# EAGLE design Clock (EAGLE 7.2.0)
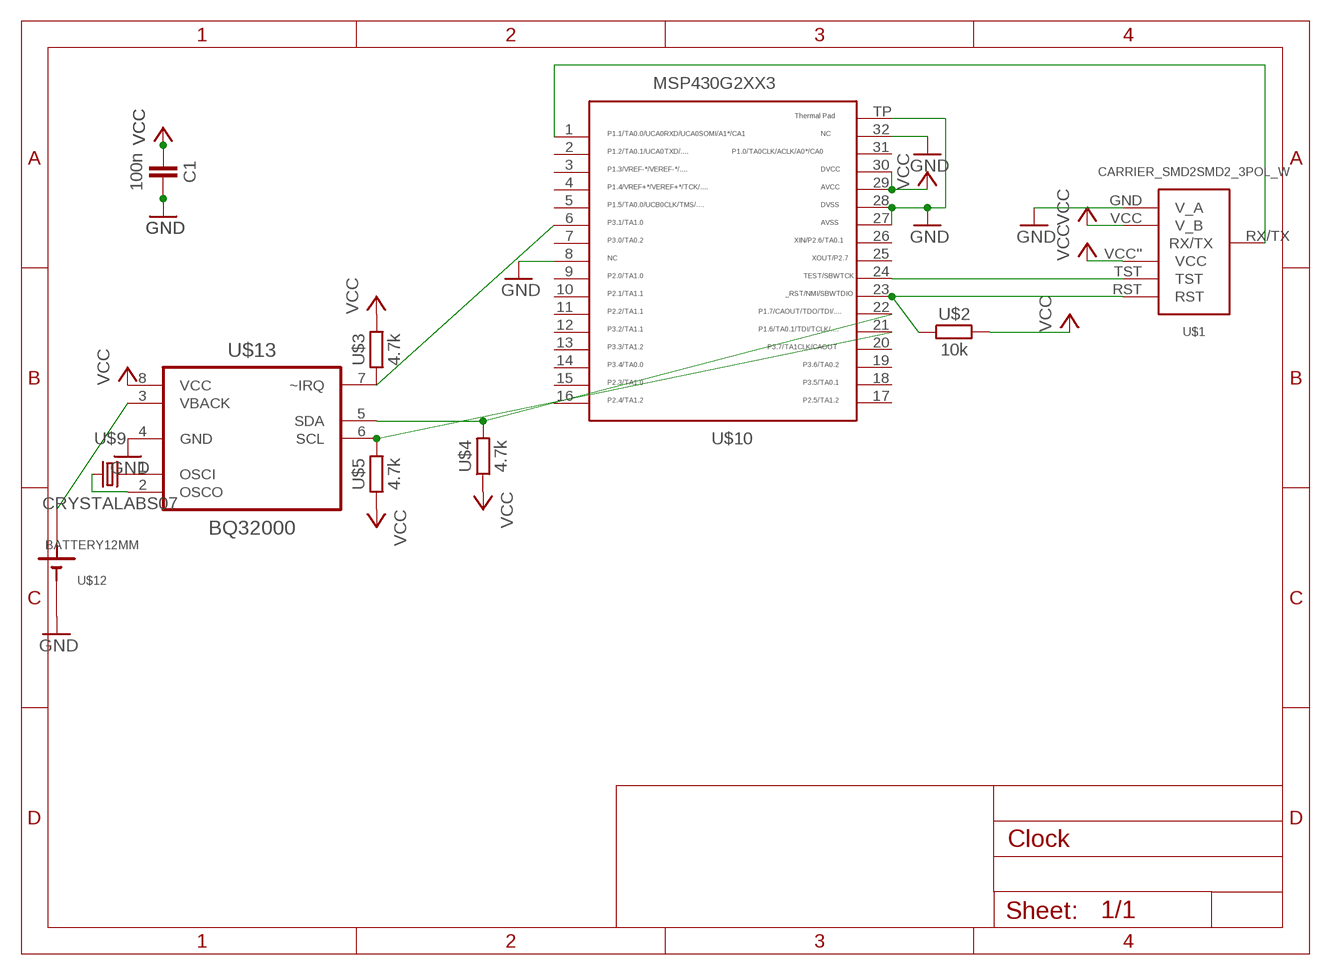
[diagram p0: schematic, sheet 1]

## Parts
C1  100n  CAPACITOR  [603]
U$1  CARRIER_SMD2SMD2_3POL_W  [CARRIER_SMD2_WIDE_3POL]
U$2  10k  RESISTOR0603  [603]
U$3  4.7k  RESISTOR0603  [603]
U$4  4.7k  RESISTOR0603  [603]
U$5  4.7k  RESISTOR0603  [603]
U$9  CRYSTALABS07  [ABS07]
U$10  MSP430G2553  [QFN32]
U$12  BATTERY12MM  [BATTERY-12MM]
U$13  BQ32000  [SOIC8]

## Nets
GND: C1.2 U$1.GND(V_A) U$10.8 U$10.27 U$10.28 U$10.32 U$10.TP U$12.GND(-) U$13.4(GND)
N$2: U$5.2 U$10.21 U$13.6(SCL)
N$3: U$1.TST U$10.24
N$4: U$1.RST U$2.1 U$10.23
N$5: U$4.2 U$10.22 U$13.5(SDA)
N$11: U$3.1 U$10.6 U$13.7(~IRQ)
N$12: U$1.RX/TX U$10.1
N$13: U$9.1 U$13.2(OSCO)
N$17: U$9.2 U$13.1(OSCI)
N$18: U$12.PWR@1(+) U$12.PWR@2(+) U$13.3(VBACK)
VCC: C1.1 U$1.VCC''(VCC) U$1.VCC(V_B) U$2.2 U$3.2 U$4.1 U$5.1 U$10.29 U$10.30 U$13.8(VCC)
Unconnected: U$10.2 U$10.3 U$10.4 U$10.5 U$10.7 U$10.9 U$10.10 U$10.11 U$10.12 U$10.13 U$10.14 U$10.15 U$10.16 U$10.17 U$10.18 U$10.19 U$10.20 U$10.25 U$10.26 U$10.31

## Library data of the parts
C1 = thar:CAPACITOR
U$1 = thar:CARRIER_SMD2
U$2-U$5 = thar:RESISTOR
U$9 = thar:CRYSTAL
U$10 = thar:MSP430G2553: TEXAS INSTRUMENTS MSP430G2553IRHB32R MCU, 16BIT, MSP430, 16MHZ, QFN-32 Farnell Best.Nr.: 2325726 Herst.Bez.: MSP430G2553IRHB32R
U$12 = thar:BATTERY
U$13 = thar:BQ32000: TEXAS INSTRUMENTS - BQ32000DR - SRL ECHTZEITUHR 8SOIC Farnell Best.Nr.: 1754773 Herst.Bez.: BQ32000DR

## Board
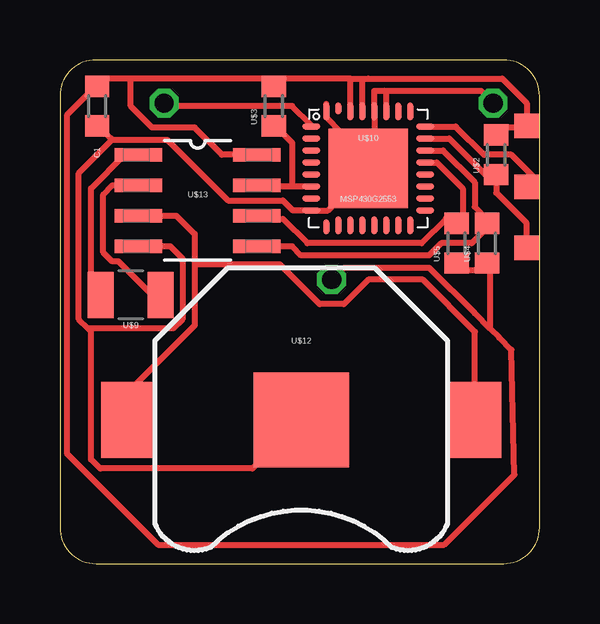
[diagram p1: board, top side]
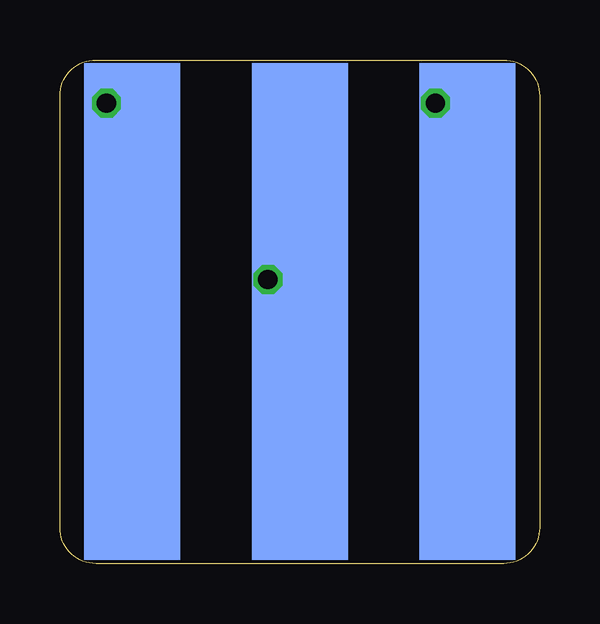
[diagram p2: board, bottom side, seen from below]

Size 20 x 21 mm. Coordinates in mm from the lower left corner, seen from the top.
Copper layers (1*16): Top 0.035mm / dielectric 1.5mm / Bottom 0.035mm
Design rules "Bilex DRU *": minimum track width 10mil, minimum drill 24mil, track to track 10mil, track to pad 10mil, pad to pad 10mil, via to via 10mil, smd to smd 10mil, copper to edge 1mil, drill to drill 8mil, minimum pad ring 10mil, minimum via ring 8mil, stop-mask expansion 4mil, vias tented up to drill 0mil, thermal gap 10mil

### Footprints (pad centres in the part's own frame; a part is rotated, then mirrored left to right if it is on the bottom)
603 = smd 0.889 x 1.016: 1 -0.826,0; 2 0.826,0
CARRIER_SMD2_WIDE_3POL = smd 4 x 20.7 bottom: GND -6.985,3.493; RX/TX 6.985,3.493; VCC 0,3.493 | smd 1.016 x 1.016: RST -9.461,0.826; TST -9.461,-1.714; VCC'' -9.461,-4.255
ABS07 = smd 1.1 x 1.9: 1 -1.25,0; 2 1.25,0
QFN32 = smd 0.762 x 0.254: 1 -2.375,1.75; 2 -2.375,1.25; 3 -2.375,0.75; 4 -2.375,0.25; 5 -2.375,-0.25; 6 -2.375,-0.75; 7 -2.375,-1.25; 8 -2.375,-1.75; 17 2.375,-1.75; 18 2.375,-1.25; 19 2.375,-0.75; 20 2.375,-0.25; 21 2.375,0.25; 22 2.375,0.75; 23 2.375,1.25; 24 2.375,1.75 | smd 0.254 x 0.635: 9 -1.75,-2.438 | smd 0.254 x 0.762: 10 -1.25,-2.375; 11 -0.75,-2.375; 12 -0.25,-2.375; 13 0.25,-2.375; 14 0.75,-2.375; 15 1.25,-2.375; 16 1.75,-2.375; 25 1.75,2.375; 26 1.25,2.375; 27 0.75,2.375; 28 0.25,2.375; 29 -0.25,2.375; 30 -0.75,2.375; 32 -1.75,2.375 | smd 0.254 x 0.508: 31 -1.25,2.5 | smd 3.302 x 3.302: TP 0,0
BATTERY-12MM = smd 3.962 x 3.962: GND 0,0 | smd 2.175 x 3.175: PWR@1 -7.25,0; PWR@2 7.25,0
SOIC8 = smd 1.981 x 0.559: 1 -2.464,1.905; 2 -2.464,0.635; 3 -2.464,-0.635; 4 -2.464,-1.905; 5 2.464,-1.905; 6 2.464,-0.635; 7 2.464,0.635; 8 2.464,1.905

### Placement (x,y rotation side)
C1  1.55,19.07 270 top
U$1  10,14 180 top
U$2  18.19,17.05 90 top
U$3  8.92,19.07 90 top
U$4  17.81,13.36 90 top
U$5  16.54,13.36 90 top
U$9  2.95,11.2 180 top
U$10  12.86,16.48 0 top
U$12  10.06,5.99 180 top
U$13  5.74,15.14 0 top

### Tracks (layer width: path | path; a pad name or v marks a point on that pad's centre or on a via)
GND  (via drill 0.8)
  Top 0.254: 13.38,16.16 12.88,17.19 13.12,17.17 | 13.38,16.16 13.43,16.13 U$10.TP 12.47,16.27 12.35,16.22 12.09,15.64 11.17,14.73 U$10.8 9.71,14.73 9.3,15.14 7.01,15.14 4.47,17.68 2.19,17.68 | 13.11,17.55 U$10.28 13.11,19.71 13.5,19.71 | 13.11,17.55 13.11,16.87 13.38,16.16 | 13.11,17.55 12.34,17.81 11.71,18 11.11,18.61 U$10.32 11.11,19.17 | v18.06,19.2 17.55,19.71 13.5,19.71 | U$10.27 13.61,19.69 13.5,19.71 | U$13.4 4.6,13.23 5.11,12.72 5.11,10.18 4.73,9.8 1.17,9.8 | 1.17,9.8 0.79,10.18 0.79,16.28 2.19,17.68 | U$12.GND 8.03,3.96 1.68,3.96 1.3,4.34 1.3,9.68 1.17,9.8 | C1.2 2.19,17.68
  Bottom 0.254: U$1.GND 18,18.63 v18.06,19.2
N$2
  Top 0.254: U$10.21 15.71,16.73 16.79,15.64 16.79,14.25 16.73,14.18 U$5.2 16.86,14.06 16.66,14.25 16.09,14.38 15.08,13.36 10.31,13.36 9.3,14.38 U$13.6
N$3
  Top 0.254: U$1.TST 19.71,16.15 18.82,17.05 17.68,17.05 16.54,18.18 16.5,18.23 U$10.24
N$4
  Top 0.254: U$2.1 18.19,15.46 19.46,14.19 U$1.RST | 18.06,16.16 17.87,16.28 U$2.1 | U$10.23 16.24,17.73 17.93,16.03 18.26,16.41 U$2.1
N$5
  Top 0.254: U$10.22 15.97,17.23 17.3,15.9 17.3,14.88 17.81,14.38 U$4.2 17.68,13.87 17.17,13.36 15.9,13.36 15.39,12.85 10.06,12.85 9.68,13.23 U$13.5
N$11
  Top 0.254: 9.68,15.73 8.16,15.73 | 8.16,15.73 U$13.7 | U$10.6 9.68,15.73 | 8.16,15.73 7.47,15.73 | U$3.1 8.98,18.25 9.68,17.55 9.68,15.73
N$12  (via drill 0.8)
  Top 0.254: v4.35,19.2 4.47,19.07 9.68,19.07 10.48,18.27 U$10.1
  Bottom 0.254: U$1.RX/TX 3.01,17.87 v4.35,19.2
N$13
  Top 0.254: U$9.1 3.84,11.2 2.44,12.6 2.19,12.6 1.81,12.98 1.81,15.39 2.19,15.77 U$13.2
N$17
  Top 0.254: U$9.2 1.7,11.35 1.3,11.58 1.3,15.64 2.7,17.04 U$13.1 3.66,17.04
N$18
  Top 0.254: U$13.3 4.85,14.5 5.62,13.74 5.62,12.47 | 5.62,12.47 5.62,9.93 2.82,7.14 2.82,6 U$12.PWR@2 | U$12.PWR@1 17.31,9.66 15.14,11.84 12.86,11.84 11.84,10.82 10.82,10.82 9.17,12.47 5.62,12.47
VCC  (via drill 0.8)
  Top 0.254: 12.86,20.22 12.11,20.22 U$10.30 12.11,20.22 9.04,20.22 | 12.86,20.22 18.44,20.22 19.46,19.2 U$1.VCC'' | U$1.VCC'' 19.65,18.25 19.71,18.32 | U$2.2 18.06,17.93 18.19,18.19 19.27,18.19 U$1.VCC'' | U$10.29 12.61,20.22 12.86,20.22 | U$4.1 17.68,12.72 17.81,12.22 | 17.81,12.22 16.47,12.22 U$5.1 | 17.93,12.22 17.81,12.22 | v11.33,11.84 11.84,12.34 15.39,12.34 17.3,10.44 17.93,9.81 | 1.81,20.22 0.28,18.69 0.28,4.6 4.09,0.79 16.03,0.79 18.95,3.71 18.82,8.91 18.31,9.43 17.93,9.81 | 17.81,12.22 17.93,12.34 17.93,9.81 | 9.04,20.22 2.95,20.22 | 2.95,20.22 1.81,20.22 | C1.1 1.81,20.22 | U$13.8 6.76,17.04 5.62,18.18 3.84,18.18 2.95,19.07 2.95,20.22 | U$3.2 8.92,20.09 9.04,20.22
  Bottom 0.254: U$1.VCC 11.77,12.03 v11.33,11.84